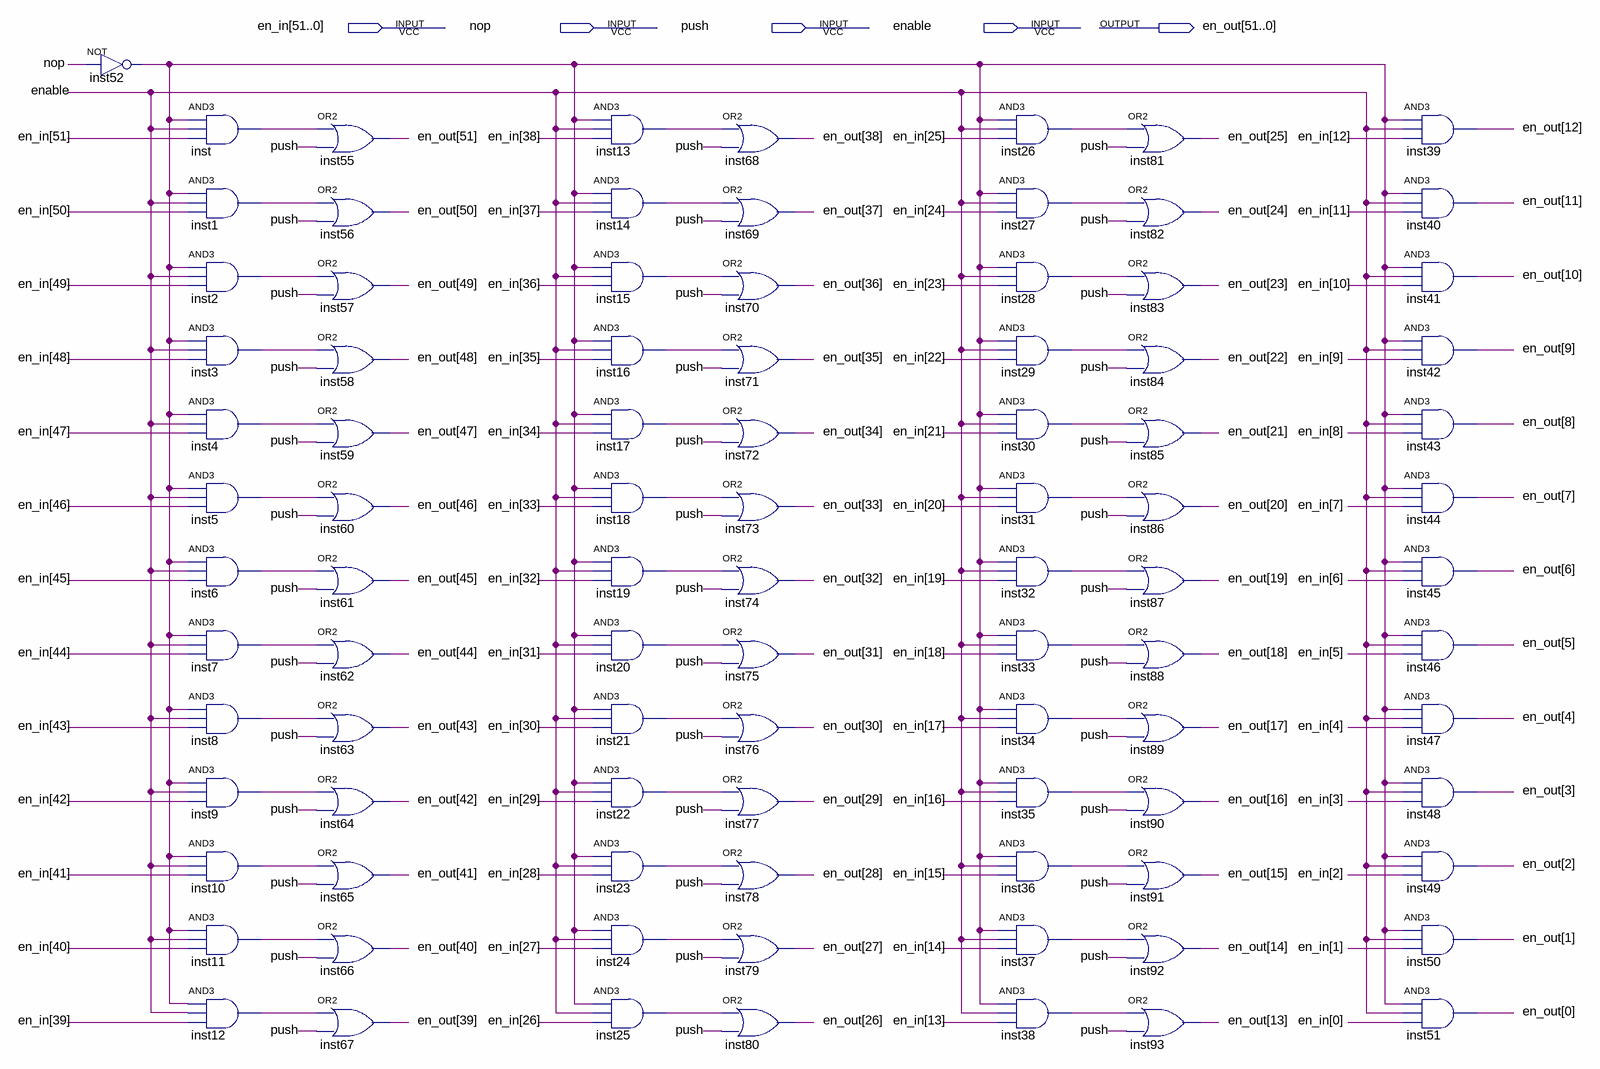
[diagram p0: schematic sheet]
// Quartus schematic gA6_ff_enable52.bdf as structural Verilog: 92 symbols, 5 pins
module gA6_ff_enable52 (
  input  [51:0] en_in,
  input  nop,
  input  push,
  input  enable,
  output [51:0] en_out
);

  wire inst1_out, inst2_out, inst3_out, inst4_out, inst5_out, inst6_out, inst7_out, inst8_out, inst9_out,
       inst10_out, inst11_out, inst12_out, inst13_out, inst14_out, inst15_out, inst16_out, inst17_out,
       inst18_out, inst19_out, inst20_out, inst21_out, inst22_out, inst23_out, inst24_out, inst25_out,
       inst26_out, inst27_out, inst28_out, inst29_out, inst30_out, inst31_out, inst32_out, inst33_out,
       inst34_out, inst35_out, inst36_out, inst37_out, inst38_out, inst52_out, inst_out;

  not inst52 (inst52_out, nop);
  and inst (inst_out, inst52_out, enable, en_in[51]);
  and inst1 (inst1_out, inst52_out, enable, en_in[50]);
  and inst2 (inst2_out, inst52_out, enable, en_in[49]);
  and inst3 (inst3_out, inst52_out, enable, en_in[48]);
  and inst4 (inst4_out, inst52_out, enable, en_in[47]);
  and inst5 (inst5_out, inst52_out, enable, en_in[46]);
  and inst6 (inst6_out, inst52_out, enable, en_in[45]);
  and inst7 (inst7_out, inst52_out, enable, en_in[44]);
  and inst8 (inst8_out, inst52_out, enable, en_in[43]);
  and inst9 (inst9_out, inst52_out, enable, en_in[42]);
  and inst10 (inst10_out, inst52_out, enable, en_in[41]);
  and inst11 (inst11_out, inst52_out, enable, en_in[40]);
  and inst12 (inst12_out, inst52_out, enable, en_in[39]);
  or inst55 (en_out[51], inst_out, push);
  or inst56 (en_out[50], inst1_out, push);
  or inst57 (en_out[49], inst2_out, push);
  or inst58 (en_out[48], inst3_out, push);
  or inst59 (en_out[47], inst4_out, push);
  or inst60 (en_out[46], inst5_out, push);
  or inst61 (en_out[45], inst6_out, push);
  or inst62 (en_out[44], inst7_out, push);
  or inst63 (en_out[43], inst8_out, push);
  or inst64 (en_out[42], inst9_out, push);
  or inst65 (en_out[41], inst10_out, push);
  or inst66 (en_out[40], inst11_out, push);
  or inst67 (en_out[39], inst12_out, push);
  and inst13 (inst13_out, inst52_out, enable, en_in[38]);
  and inst14 (inst14_out, inst52_out, enable, en_in[37]);
  and inst15 (inst15_out, inst52_out, enable, en_in[36]);
  and inst16 (inst16_out, inst52_out, enable, en_in[35]);
  and inst17 (inst17_out, inst52_out, enable, en_in[34]);
  and inst18 (inst18_out, inst52_out, enable, en_in[33]);
  and inst19 (inst19_out, inst52_out, enable, en_in[32]);
  and inst20 (inst20_out, inst52_out, enable, en_in[31]);
  and inst21 (inst21_out, inst52_out, enable, en_in[30]);
  and inst22 (inst22_out, inst52_out, enable, en_in[29]);
  and inst23 (inst23_out, inst52_out, enable, en_in[28]);
  and inst24 (inst24_out, inst52_out, enable, en_in[27]);
  and inst25 (inst25_out, inst52_out, enable, en_in[26]);
  or inst68 (en_out[38], inst13_out, push);
  or inst69 (en_out[37], inst14_out, push);
  or inst70 (en_out[36], inst15_out, push);
  or inst71 (en_out[35], inst16_out, push);
  or inst72 (en_out[34], inst17_out, push);
  or inst73 (en_out[33], inst18_out, push);
  or inst74 (en_out[32], inst19_out, push);
  or inst75 (en_out[31], inst20_out, push);
  or inst76 (en_out[30], inst21_out, push);
  or inst77 (en_out[29], inst22_out, push);
  or inst78 (en_out[28], inst23_out, push);
  or inst79 (en_out[27], inst24_out, push);
  or inst80 (en_out[26], inst25_out, push);
  and inst26 (inst26_out, inst52_out, enable, en_in[25]);
  and inst27 (inst27_out, inst52_out, enable, en_in[24]);
  and inst28 (inst28_out, inst52_out, enable, en_in[23]);
  and inst29 (inst29_out, inst52_out, enable, en_in[22]);
  and inst30 (inst30_out, inst52_out, enable, en_in[21]);
  and inst31 (inst31_out, inst52_out, enable, en_in[20]);
  and inst32 (inst32_out, inst52_out, enable, en_in[19]);
  and inst33 (inst33_out, inst52_out, enable, en_in[18]);
  and inst34 (inst34_out, inst52_out, enable, en_in[17]);
  and inst35 (inst35_out, inst52_out, enable, en_in[16]);
  and inst36 (inst36_out, inst52_out, enable, en_in[15]);
  and inst37 (inst37_out, inst52_out, enable, en_in[14]);
  and inst38 (inst38_out, inst52_out, enable, en_in[13]);
  or inst81 (en_out[25], inst26_out, push);
  or inst82 (en_out[24], inst27_out, push);
  or inst83 (en_out[23], inst28_out, push);
  or inst84 (en_out[22], inst29_out, push);
  or inst85 (en_out[21], inst30_out, push);
  or inst86 (en_out[20], inst31_out, push);
  or inst87 (en_out[19], inst32_out, push);
  or inst88 (en_out[18], inst33_out, push);
  or inst89 (en_out[17], inst34_out, push);
  or inst90 (en_out[16], inst35_out, push);
  or inst91 (en_out[15], inst36_out, push);
  or inst92 (en_out[14], inst37_out, push);
  or inst93 (en_out[13], inst38_out, push);
  and inst39 (en_out[12], inst52_out, enable, en_in[12]);
  and inst40 (en_out[11], inst52_out, enable, en_in[11]);
  and inst41 (en_out[10], inst52_out, enable, en_in[10]);
  and inst42 (en_out[9], inst52_out, enable, en_in[9]);
  and inst43 (en_out[8], inst52_out, enable, en_in[8]);
  and inst44 (en_out[7], inst52_out, enable, en_in[7]);
  and inst45 (en_out[6], inst52_out, enable, en_in[6]);
  and inst46 (en_out[5], inst52_out, enable, en_in[5]);
  and inst47 (en_out[4], inst52_out, enable, en_in[4]);
  and inst48 (en_out[3], inst52_out, enable, en_in[3]);
  and inst49 (en_out[2], inst52_out, enable, en_in[2]);
  and inst50 (en_out[1], inst52_out, enable, en_in[1]);
  and inst51 (en_out[0], inst52_out, enable, en_in[0]);
endmodule
